# Altium project TFG_Dispositivo.PrjPcb
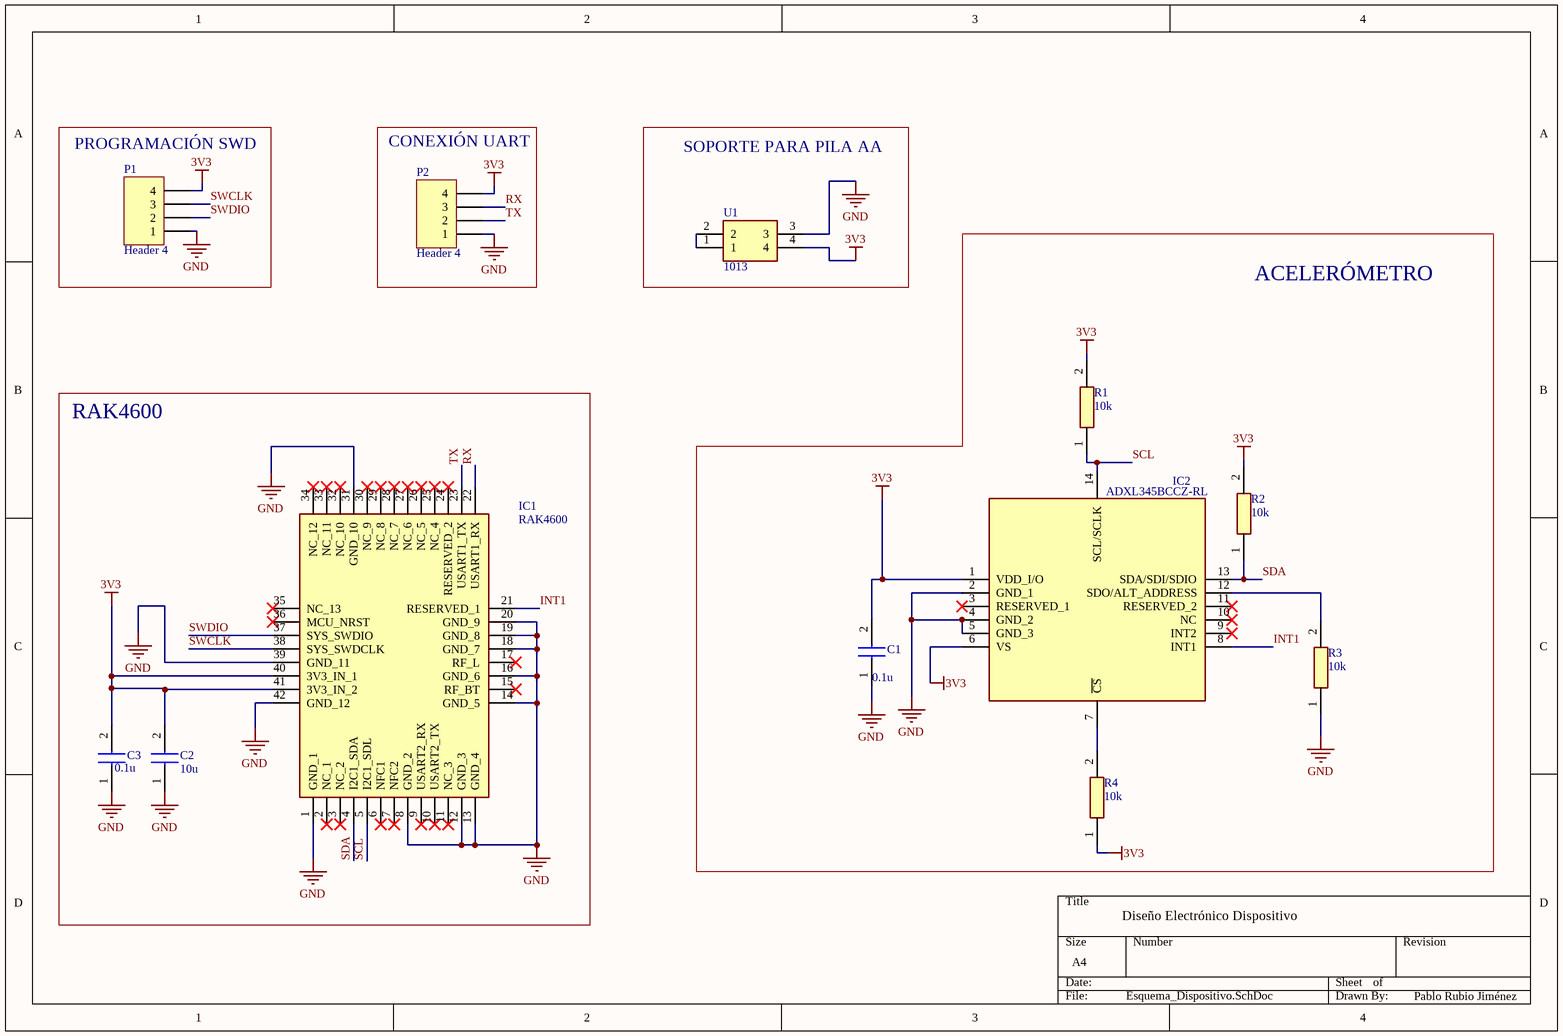
[diagram p0: Esquema_Dispositivo.SchDoc]
1 sheet, 12 parts. Net scope: global (net labels, ports and power ports of the same name join across sheets).
Board file: PCB_Dispositivo.PcbDoc

## Sheet Esquema_Dispositivo.SchDoc
size A4; SheetNumber: 1; SheetTotal: 1

### Parts
C1  0.1u  [CAPC2012X98N]
C2  10u  [CAPC1608X90N]
C3  0.1u  [CAPC2012X98N]
IC1  RAK4600  [RAK4600]
IC2  ADXL345BCCZ-RL  [ADXL345BCCZRL]
P1  Header 4  [HDR1X4]
P2  Header 4  [HDR1X4]
R1  10k  [RESC1005X35N]
R2  10k  [RESC1005X35N]
R3  10k  [RESC1005X35N]
R4  10k  [RESC1005X35N]
U1  1013  [1013]

### Blocks framed on the sheet
PROGRAMACIÓN SWD: P1
CONEXIÓN UART: P2
SOPORTE PARA PILA AA: U1
ACELERÓMETRO: C1 IC2 R1-R4
RAK4600: C2 C3 IC1

### Nets
3V3: C1.2 C2.2 C3.2 IC1.40(3V3_IN_1) IC1.41(3V3_IN_2) IC2.1(VDD_I/O) IC2.6(VS) P1.4 P2.4 R1.2 R2.2 R4.1 U1.4
GND: C1.1 C2.1 C3.1 IC1.1(GND_1) IC1.8(GND_2) IC1.12(GND_3) IC1.13(GND_4) IC1.14(GND_5) IC1.16(GND_6) IC1.18(GND_7) IC1.19(GND_8) IC1.20(GND_9) IC1.31(GND_10) IC1.39(GND_11) IC1.42(GND_12) IC2.2(GND_1) IC2.4(GND_2) IC2.5(GND_3) P1.1 P2.1 R3.1 U1.3
INT1: IC1.21(RESERVED_1) IC2.8(INT1)
RX: IC1.22(USART1_RX) P2.3
SCL: IC1.5(I2C1_SDL) IC2.14(SCL/SCLK) R1.1
SDA: IC1.4(I2C1_SDA) IC2.13(SDA/SDI/SDIO) R2.1
SWCLK: IC1.38(SYS_SWDCLK) P1.3
SWDIO: IC1.37(SYS_SWDIO) P1.2
TX: IC1.23(USART1_TX) P2.2
NetIC2_7: IC2.7(~{CS}) R4.2
NetIC2_12: IC2.12(SDO/ALT_ADDRESS) R3.2
NetU1_1: U1.1 U1.2

Not connected (* = marked no-connect by the designer): IC1 2(NC_1)* 3(NC_2)* 6(NFC1)* 7(NFC2)* 9(USART2_RX)* 10(USART2_TX)* 11(NC_3)* 15(RF_BT)* 17(RF_L)* 24(RESERVED_2)* 25(NC_4)* 26(NC_5)* 27(NC_6)* 28(NC_7)* 29(NC_8)* 30(NC_9)* 32(NC_10)* 33(NC_11)* 34(NC_12)* 35(NC_13)* 36(MCU_NRST)*; IC2 3(RESERVED_1)* 9(INT2)* 10(NC)* 11(RESERVED_2)*

### Notes on the sheet
- Diseño Electrónico Dispositivo
- Pablo Rubio Jiménez

### Library data of the parts
C1 C3 = C0805X104M5RACTU: Capacitor; Manufacturer_Name: Kemet; Datasheet Link: https://componentsearchengine.com/Datasheets/2/C0805X104M5RACTU.pdf; Height: 0.98mm; Manufacturer_Part_Number: C0805X104M5RACTU; Mouser Part Number: 80-C0805X104M5RACTU; Mouser Price/Stock: https://www.mouser.co.uk/ProductDetail/KEMET/C0805X104M5RACTU/?qs=1xOl%2F8aMGNq7VJopyoJi7Q%3D%3D
C2 = 0603ZD106KAT2A: Capacitor; Manufacturer_Name: AVX; Datasheet Link: https://componentsearchengine.com/Datasheets/1/06031A100FAT2A.pdf; Height: 0.9mm; Manufacturer_Part_Number: 0603ZD106KAT2A; Mouser Part Number: 581-0603ZD106KAT2A; Mouser Price/Stock: https://www.mouser.co.uk/ProductDetail/AVX/0603ZD106KAT2A?qs=c1aAEamvUYHQhwHZOF6y0Q%3D%3D; Arrow Part Number: 0603ZD106KAT2A; Arrow Price/Stock: https://www.arrow.com/en/products/0603zd106kat2a/avx
IC1 = RAK4600: Integrated Circuit; Manufacturer_Name: RAK; Datasheet Link: https://doc.rakwireless.com/datasheet/rakproducts/rak4600-lora-module-datasheet; Height: 2.5mm; Manufacturer_Part_Number: RAK4600
IC2 = ADXL345BCCZ-RL: Integrated Circuit; Manufacturer_Name: Analog Devices; Datasheet Link: https://www.analog.com/media/en/technical-documentation/data-sheets/ADXL345.pdf; Height: 1mm; Manufacturer_Part_Number: ADXL345BCCZ-RL; Mouser Part Number: 584-ADXL345BCCZ-R; Mouser Price/Stock: https://www.mouser.co.uk/ProductDetail/Analog-Devices/ADXL345BCCZ-RL/?qs=WIvQP4zGangSXrz9XHbgiA%3D%3D; Arrow Part Number: ADXL345BCCZ-RL; Arrow Price/Stock: https://www.arrow.com/en/products/adxl345bccz-rl/analog-devices
P1 P2 = Header 4: Header, 4-Pin; LatestRevisionDate: 17-Jul-2002; LatestRevisionNote: Re-released for DXP Platform.; Publisher: Altium Limited
R1-R4 = CPF0402B10KE: Resistor; Manufacturer_Name: TE Connectivity; Datasheet Link: http://www.farnell.com/datasheets/1786775.pdf; Height: 0.35mm; Manufacturer_Part_Number: CPF0402B10KE; Mouser Part Number: 279-CPF0402B10KE; Mouser Price/Stock: https://www.mouser.co.uk/ProductDetail/TE-Connectivity-Holsworthy/CPF0402B10KE?qs=DfH2yQaBz6uZ%252B76PTlIrhA%3D%3D
U1 = 1013: Undefined or Miscellaneous; Manufacturer_Name: Keystone Electronics; Datasheet Link: http://www.keyelco.com/product-pdf.cfm?p=923; Height: 14mm; Manufacturer_Part_Number: 1013; Mouser Part Number: 534-1013; Mouser Price/Stock: https://www.mouser.co.uk/ProductDetail/Keystone-Electronics/1013?qs=%2F7TOpeL5Mz787Zw6AZiIzA%3D%3D; Arrow Part Number: 1013; Arrow Price/Stock: https://www.arrow.com/en/products/1013/keystone-electronics